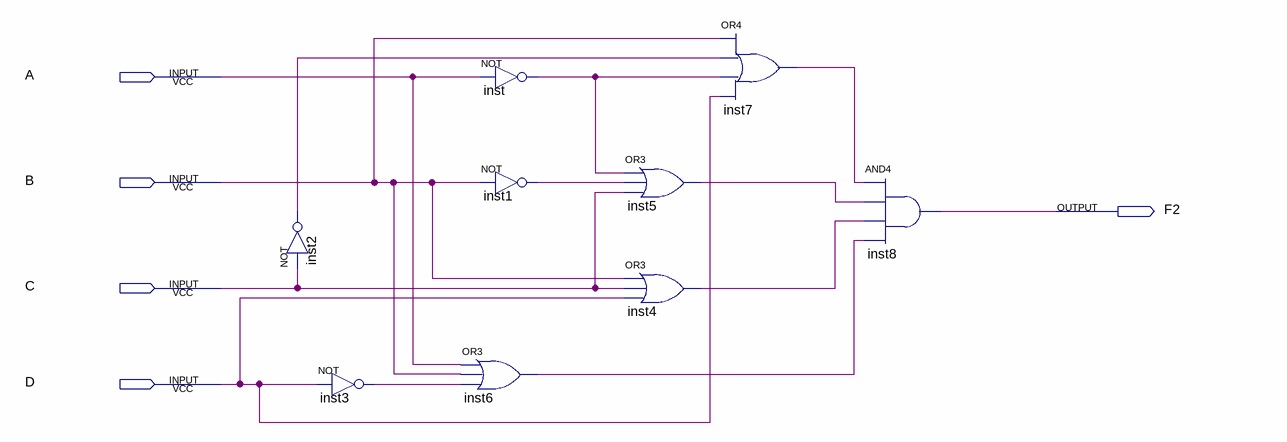
[diagram p0: schematic sheet]
// Quartus schematic LAB02_Cau3.bdf as structural Verilog: 9 symbols, 5 pins
module LAB02_Cau3 (
  input  A,
  input  B,
  input  C,
  input  D,
  output F2
);

  wire inst1_out, inst2_out, inst3_out, inst4_out, inst5_out, inst6_out, inst7_out, inst_out;

  not inst2 (inst2_out, C);
  not inst3 (inst3_out, D);
  or inst6 (inst6_out, A, B, inst3_out);
  not inst (inst_out, A);
  not inst1 (inst1_out, B);
  or inst5 (inst5_out, inst_out, inst1_out, C);
  or inst4 (inst4_out, B, C, D);
  or inst7 (inst7_out, B, inst2_out, inst_out, D);
  and inst8 (F2, inst7_out, inst5_out, inst4_out, inst6_out);
endmodule
